# Altium schematic sheet TM4C123GH6PM_1.SchDoc
size A4
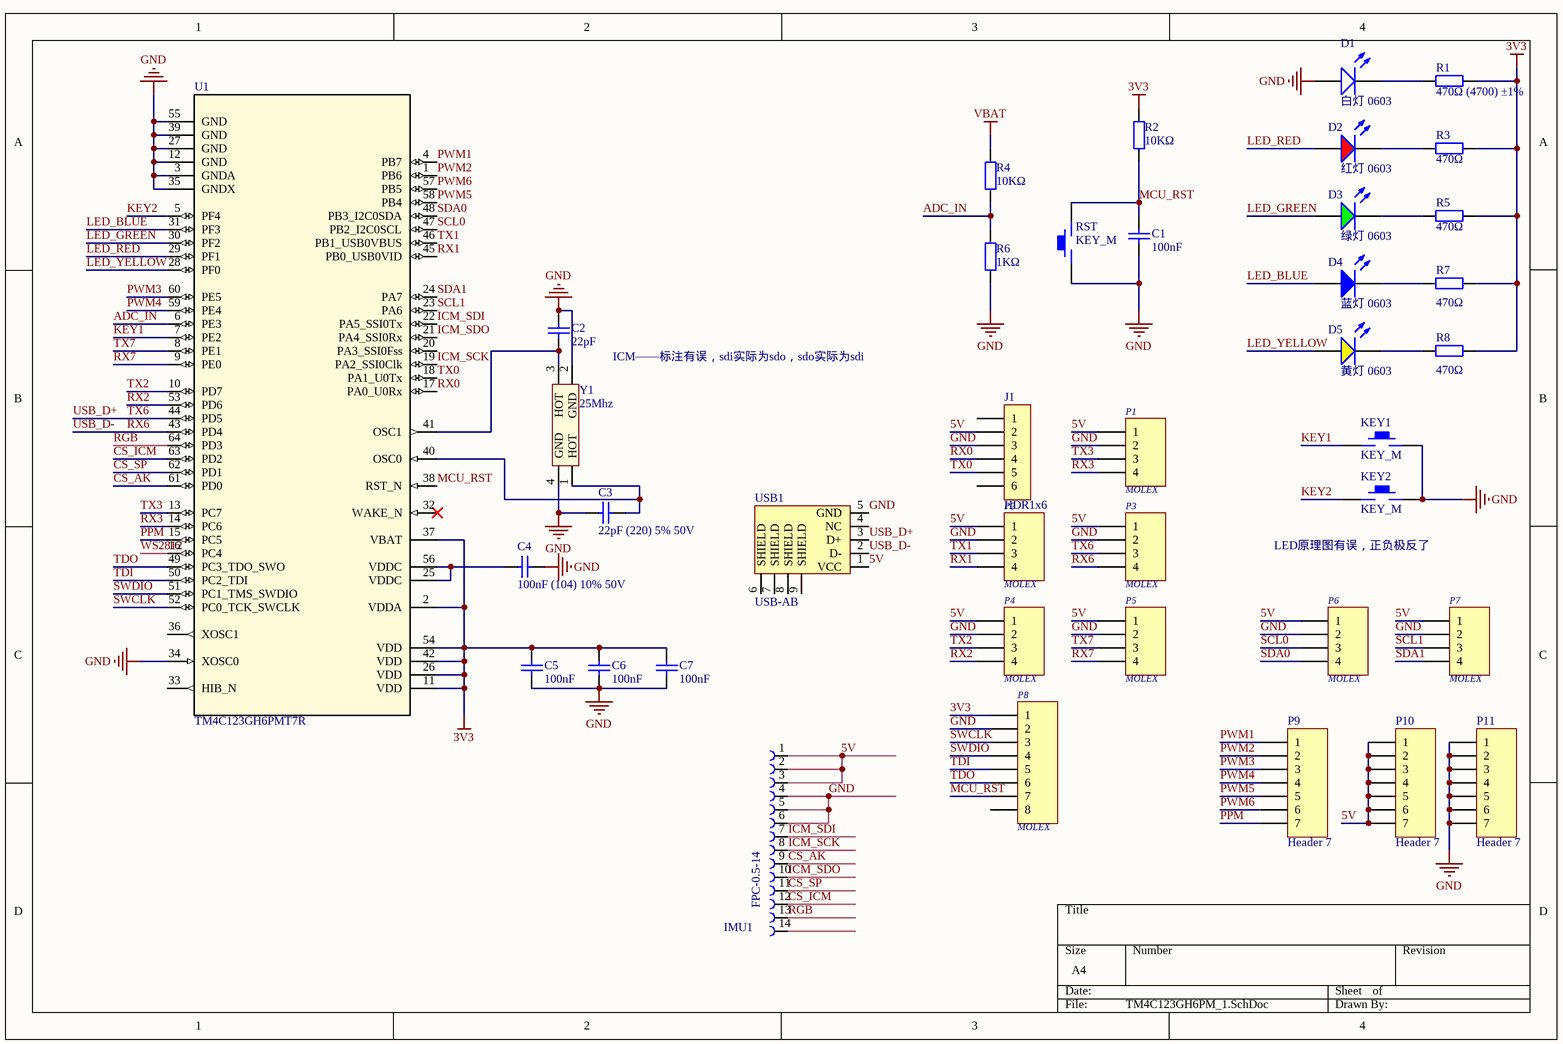
[diagram p0: TM4C123GH6PM_1.SchDoc]

## Parts
C1  100nF  [0603_C]
C2  22pF  [0603_C]
C3  22pF (220) 5% 50V  [0603_C]
C4  100nF (104) 10% 50V  [0603_C]
C5  100nF  [0603_C]
C6  100nF  [0603_C]
C7  100nF  [0603_C]
D1  白灯 0603  [0603_LED_S1]
D2  红灯 0603  [0603_LED_S1]
D3  绿灯 0603  [0603_LED_S1]
D4  蓝灯 0603  [0603_LED_S1]
D5  黄灯 0603  [0603_LED_S1]
IMU1  FPC-0.5-14  [FPC-0.5-14]
J1  HDR1x6  [PIN-6-2.54-1.0]
KEY1  KEY_M  [KEY_SOP3625]
KEY2  KEY_M  [KEY_SOP3625]
P1  MOLEX  [1.25 molex]
P2  MOLEX  [1.25 molex]
P3  MOLEX  [1.25 molex]
P4  MOLEX  [1.25 molex]
P5  MOLEX  [1.25 molex]
P6  MOLEX  [1.25 molex]
P7  MOLEX  [1.25 molex]
P8  MOLEX  [1.25 molex -8]
P9  Header 7  [HDR1X7]
P10  Header 7  [HDR1X7]
P11  Header 7  [HDR1X7]
R1  470Ω (4700) ±1%  [0603_R]
R2  10KΩ  [0603_R]
R3  470Ω  [0603_R]
R4  10KΩ  [0603_R]
R5  470Ω  [0603_R]
R6  1KΩ  [0603_R]
R7  470Ω  [0603_R]
R8  470Ω  [0603_R]
RST  KEY_M  [KEY_SOP3625]
U1  TM4C123GH6PMT7R  [PM0064A_M]
USB1  USB-AB  [USB_AB - 5S - B]
Y1  25Mhz  [XTAL3225]

## Nets
3V3: C5.2 C6.2 C7.2 P8.1 R1.2 R2.2 R3.2 R5.2 R7.2 R8.2 U1.2(VDDA) U1.11(VDD) U1.26(VDD) U1.37(VBAT) U1.42(VDD) U1.54(VDD)
GND: C1.1 C2.2 C3.2 C4.2 C5.1 C6.1 C7.1 D1.A IMU1.4 IMU1.5 IMU1.6 J1.3 KEY1.2 KEY2.2 P1.2 P2.2 P3.2 P4.2 P5.2 P6.2 P7.2 P8.2 P11.1 P11.2 P11.3 P11.4 P11.5 P11.6 P11.7 R6.1 RST.1 U1.3(GNDA) U1.12(GND) U1.27(GND) U1.34(XOSC0) U1.35(GNDX) U1.39(GND) U1.55(GND) USB1.5(GND) Y1.2(GND) Y1.4(GND)
VBAT: R4.2
5V: IMU1.1 IMU1.2 IMU1.3 J1.2 P1.1 P2.1 P3.1 P4.1 P5.1 P6.1 P7.1 P10.1 P10.2 P10.3 P10.4 P10.5 P10.6 P10.7 USB1.1(VCC)
ADC_IN: R4.1 R6.2 U1.6(PE3)
CS_AK: IMU1.9 U1.61(PD0)
CS_ICM: IMU1.12 U1.63(PD2)
CS_SP: IMU1.11 U1.62(PD1)
ICM_SCK: IMU1.8 U1.19(PA2_SSI0Clk)
ICM_SDI: IMU1.7 U1.22(PA5_SSI0Tx)
ICM_SDO: IMU1.10 U1.21(PA4_SSI0Rx)
KEY1: KEY1.1 U1.7(PE2)
KEY2: KEY2.1 U1.5(PF4)
LED_BLUE: D4.A U1.31(PF3)
LED_GREEN: D3.A U1.30(PF2)
LED_RED: D2.A U1.29(PF1)
LED_YELLOW: D5.A U1.28(PF0)
MCU_RST: C1.2 P8.7 R2.1 RST.2 U1.38(RST_N)
PPM: P9.7 U1.15(PC5)
PWM1: P9.1 U1.4(PB7)
PWM2: P9.2 U1.1(PB6)
PWM3: P9.3 U1.60(PE5)
PWM4: P9.4 U1.59(PE4)
PWM5: P9.5 U1.58(PB4)
PWM6: P9.6 U1.57(PB5)
RGB: IMU1.13 U1.64(PD3)
RX0: J1.4 U1.17(PA0_U0Rx)
RX1: P2.4 U1.45(PB0_USB0VID)
RX2: P4.4 U1.53(PD6)
RX3: P1.4 U1.14(PC6)
RX6: P3.4 U1.43(PD4) USB1.2(D-)  [also labelled USB_D-]
RX7: P5.4 U1.9(PE0)
SCL0: P6.3 U1.47(PB2_I2C0SCL)
SCL1: P7.3 U1.23(PA6)
SDA0: P6.4 U1.48(PB3_I2C0SDA)
SDA1: P7.4 U1.24(PA7)
SWCLK: P8.3 U1.52(PC0_TCK_SWCLK)
SWDIO: P8.4 U1.51(PC1_TMS_SWDIO)
TDI: P8.5 U1.50(PC2_TDI)
TDO: P8.6 U1.49(PC3_TDO_SWO)
TX0: J1.5 U1.18(PA1_U0Tx)
TX1: P2.3 U1.46(PB1_USB0VBUS)
TX2: P4.3 U1.10(PD7)
TX3: P1.3 U1.13(PC7)
TX6: P3.3 U1.44(PD5) USB1.3(D+)  [also labelled USB_D+]
TX7: P5.3 U1.8(PE1)
WS2812: U1.16(PC4)
NetC2_1: C2.1 U1.41(OSC1) Y1.3(HOT)
NetC3_1: C3.1 U1.40(OSC0) Y1.1(HOT)
NetC4_1: C4.1 U1.25(VDDC) U1.56(VDDC)
NetD1_K: D1.K R1.1
NetD2_K: D2.K R3.1
NetD3_K: D3.K R5.1
NetD4_K: D4.K R7.1
NetD5_K: D5.K R8.1

Not connected (* = marked no-connect by the designer): IMU1 14(1); J1 1 6; P8 8; U1 20(PA3_SSI0Fss) 32(WAKE_N)* 33(HIB_N) 36(XOSC1); USB1 4(NC) 6(SHIELD) 7(SHIELD) 8(SHIELD) 9(SHIELD)

## Notes on the sheet
- ICM——标注有误，sdi实际为sdo，sdo实际为sdi
- (near KEY2) LED原理图有误，正负极反了

## Library data of the parts
C1 C4-C7 = 0603 100nF (104) 10% 50V: 贴片电容; ComponentLink1Description: 供应商链接; ComponentLink1URL: http://www.szlcsc.com/product/details_15331.html; Package: 0603; Supplier: LC; SuppliersPartNumber: C14663
C2 C3 = 0603 22pF (220) 5% 50V: 贴片电容; ComponentLink1Description: 供应商链接; ComponentLink1URL: http://www.szlcsc.com/product/details_2005.html; Package: 0603; Supplier: LC; SuppliersPartNumber: C1653
D1 = 0603 白灯: 发光二极管; ComponentLink1Description: 供应商链接; ComponentLink1URL: http://www.szlcsc.com/product/details_2663.html; Package: 0603; Supplier: LC; SuppliersPartNumber: C2290
D2 = 0603 红灯: 发光二极管; ComponentLink1Description: 供应商链接; ComponentLink1URL: http://www.szlcsc.com/product/details_2659.html; Package: 0603; Supplier: LC; SuppliersPartNumber: C2286
D3 = 0603 绿灯: 发光二极管; ComponentLink1Description: 供应商链接; ComponentLink1URL: http://www.szlcsc.com/product/details_73152.html; Package: 0603; Supplier: LC; SuppliersPartNumber: C72043
D4 = 0603 蓝灯: 发光二极管; ComponentLink1Description: 供应商链接; ComponentLink1URL: http://www.szlcsc.com/product/details_73150.html; Package: 0603; Supplier: LC; SuppliersPartNumber: C72041
D5 = 0603 黄灯: 发光二极管; ComponentLink1Description: 供应商链接; ComponentLink1URL: http://www.szlcsc.com/product/details_73147.html; Package: 0603; Supplier: LC; SuppliersPartNumber: C72038
IMU1 = FPC-0.5-14: FFC / FPC Board Connector, WR-FPC Series, Surface Mount, Receptacle, 14, Bottom, 0.5 mm; MP: 687114149022; MF: Wurth Electronics; SnapEDA_Link: https://www.snapeda.com/parts/687114149022/Wurth%20Electronics%20Inc./view-part/?ref=snap; Availability: Unavailable; Price: None; Package: None; Value: *
J1 = HDR1x6: Connector
P1-P7 = Header 4: LatestRevisionDate: 17-Jul-2002; LatestRevisionNote: Re-released for DXP Platform.; Publisher: Altium Limited
P8 = Header 8: LatestRevisionDate: 17-Jul-2002; LatestRevisionNote: Re-released for DXP Platform.; Publisher: Altium Limited
P9-P11 = Header 7: Header, 7-Pin; LatestRevisionDate: 17-Jul-2002; LatestRevisionNote: Re-released for DXP Platform.; Publisher: Altium Limited
R1 R3 R5 R7 R8 = 0603 470Ω (4700) 1%: 贴片电阻; ComponentLink1Description: 供应商链接; ComponentLink1URL: http://www.szlcsc.com/product/details_23906.html; Package: 0603; Supplier: LC; SuppliersPartNumber: C23179
R2 R4 = 0603 10KΩ (1002) 1%: 贴片电阻; ComponentLink1Description: 供应商链接; ComponentLink1URL: http://www.szlcsc.com/product/details_26547.html; Package: 0603; Supplier: LC; SuppliersPartNumber: C25804
R6 = 0603 1KΩ (1001) 1%: 贴片电阻; ComponentLink1Description: 供应商链接; ComponentLink1URL: http://www.szlcsc.com/product/details_21904.html; Package: 0603; Supplier: LC; SuppliersPartNumber: C21190
U1 = TM4C123GH6PMT7R: Imported; PartNumber: TM4C123GH6PMTR; Manufacturer: Texas Instruments; CompType: IC; PIN_COUNT: 64; Application_BuildNumber: *; Alternate_PartNumber: TM4C123GH6PMT; PackageReference: PM0064A; MountType: SMT; RoHS: Y; RefDes: RefDes; TYPE: TYPE; Value: Value
USB1 = USB-AB: MicroUSB
Y1 = XTAL_3225: 3225贴片无源晶振